# EAGLE schematic XstractiK_Domination_Player_UpperArm_V1 (EAGLE 9.6.2)

## Sheet 1 of 2
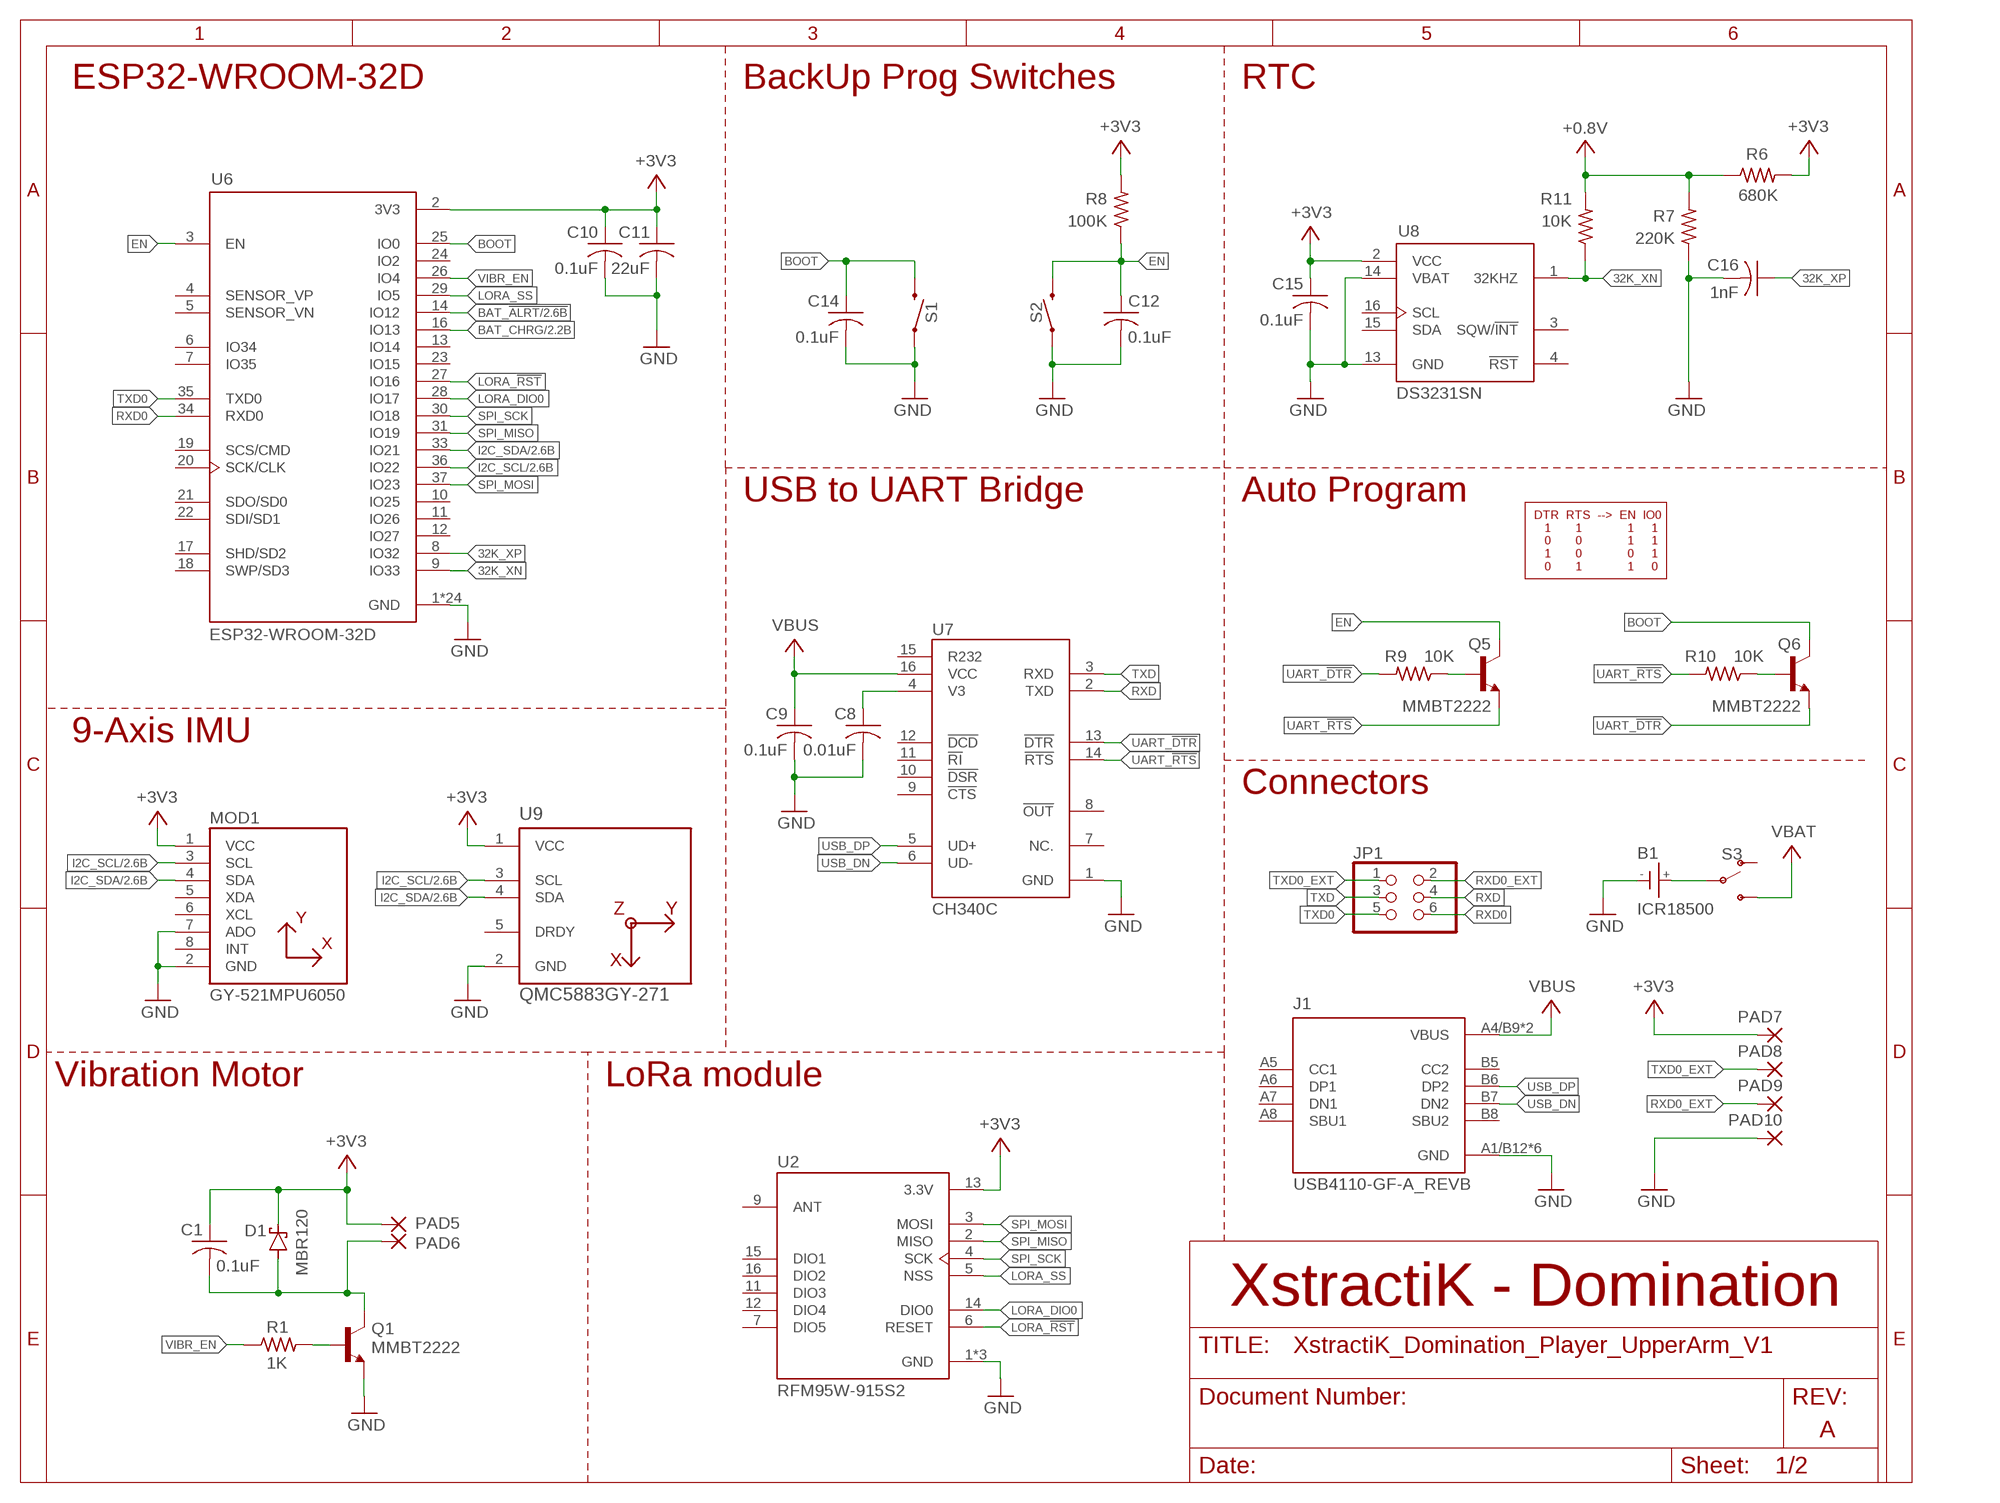
[diagram p0: schematic, sheet 1]

### Parts
B1  ICR18500  [ICR18500]
C1  0.1uF  C-USC0805  [C0805]
C8  0.01uF  C-USC0805  [C0805]
C9  0.1uF  C-USC0805  [C0805]
C10  0.1uF  C-USC0805  [C0805]
C11  22uF  C-USC0805  [C0805]
C12  0.1uF  C-USC0805  [C0805]
C14  0.1uF  C-USC0805  [C0805]
C15  0.1uF  C-USC0805  [C0805]
C16  1nF  C-USC0805  [C0805]
D1  ON_SEMICONDUCTOR_MBR120VLSFT1GON_SEMICONDUCTOR_MBR120VLSFT1G_0_0  [ON_SEMICONDUCTOR_MBR120VLSFT1G_0]
J1  USB4110-GF-A_REVB  [GCT_USB4110-GF-A_REVB]
JP1  PINHD-2X3  [2X03]
MOD1  GY-521MPU6050  [GY-521]
PAD5  WIREPAD1,6/0,8  [1,6/0,8]
PAD6  WIREPAD1,6/0,8  [1,6/0,8]
PAD7  WIREPADSMD1,27-254  [SMD1,27-2,54]
PAD8  WIREPADSMD1,27-254  [SMD1,27-2,54]
PAD9  WIREPADSMD1,27-254  [SMD1,27-2,54]
PAD10  WIREPADSMD1,27-254  [SMD1,27-2,54]
Q1  MMBT2222  [SOT23-BEC]
Q5  MMBT2222  [SOT23-BEC]
Q6  MMBT2222  [SOT23-BEC]
R1  1K  R-US_R0805  [R0805]
R6  680K  R-US_R0805  [R0805]
R7  220K  R-US_R0805  [R0805]
R8  100K  R-US_R0805  [R0805]
R9  10K  R-US_R0805  [R0805]
R10  10K  R-US_R0805  [R0805]
R11  10K  R-US_R0805  [R0805]
S1  MOMENTARY-SWITCH-SPST-SMD-5.2MM-TALL  [TACTILE_SWITCH_SMD_5.2MM]
S2  MOMENTARY-SWITCH-SPST-SMD-5.2MM-TALL  [TACTILE_SWITCH_SMD_5.2MM]
S3  SWITCH-SPDT-SMD-RIGHT-ANGLE  [SWITCH_SPST_SMD_A]
U2  RFM95W-915S2  [XCVR_RFM95W-915S2]
U6  ESP32-WROOM-32D  [MODULE_ESP32-WROOM-32D]
U7  CH340C  [SOIC127P600X180-16N]
U8  DS3231SN  [SOIC127P1032X265-16N]
U9  QMC5883GY-271  [GY-271]

### Nets
32K_XN: R11.1 U6.9(IO33) U8.1(32KHZ)
32K_XP: C16.1 U6.8(IO32)
+: B1.+ S3.2(P)
+0.8V: R6.1 R7.2 R11.2
+3V3: C1.1 C10.1 C11.1 C15.1 D1.1(K) MOD1.1(VCC) PAD5.1(P) PAD7.1(P) R6.2 R8.2 U2.13(3.3V) U6.2(3V3) U8.2(VCC) U9.1(VCC) ; also sheet 2
-: B1.- ; supply symbol labelled GND
BAT_!ALRT: U6.14(IO12) ; also sheet 2
BAT_CHRG: U6.16(IO13) ; also sheet 2
BOOT: C14.1 Q6.C S1.3 U6.25(IO0)
EN: C12.1 Q5.C R8.1 S2.3 U6.3(EN)
GND: C8.2 C9.2 C10.2 C11.2 C12.2 C14.2 C15.2 C16.2 J1.A1/B12(GND) J1.B1/A12(GND) J1.S1(GND) J1.S2(GND) J1.S3(GND) J1.S4(GND) MOD1.2(GND) MOD1.7(ADO) PAD10.1(P) Q1.E R7.1 S1.1 S2.1 U2.1(GND) U2.8(GND) U2.10(GND) U6.1(GND) U6.15(GND) U6.38(GND) U6.39_1(GND) U6.39_2(GND) U6.39_3(GND) U6.39_4(GND) U6.39_5(GND) U6.39_6(GND) U6.39_7(GND) U6.39_8(GND) U6.39_9(GND) U6.39_10(GND) U6.39_11(GND) U6.39_12(GND) U6.39_13(GND) U6.39_14(GND) U6.39_15(GND) U6.39_16(GND) U6.39_17(GND) U6.39_18(GND) U6.39_19(GND) U6.39_20(GND) U6.39_21(GND) U7.1(GND) U8.13(GND) U8.14(VBAT) U9.2(GND) ; also sheet 2
I2C_SCL: MOD1.3(SCL) U6.36(IO22) U9.3(SCL) ; also sheet 2
I2C_SDA: MOD1.4(SDA) U6.33(IO21) U9.4(SDA) ; also sheet 2
LORA_!RST: U2.6(RESET) U6.27(IO16)
LORA_DIO0: U2.14(DIO0) U6.28(IO17)
LORA_SS: U2.5(NSS) U6.29(IO5)
M-: C1.2 D1.2(A) PAD6.1(P) Q1.C
N$2: Q1.B R1.2
N$6: Q6.B R10.1
N$7: Q5.B R9.1
RXD: JP1.4 U7.2(TXD)
RXD0: JP1.6 U6.34(RXD0)
RXD0_EXT: JP1.2 PAD9.1(P)
SPI_MISO: U2.2(MISO) U6.31(IO19)
SPI_MOSI: U2.3(MOSI) U6.37(IO23)
SPI_SCK: U2.4(SCK) U6.30(IO18)
TXD: JP1.3 U7.3(RXD)
TXD0: JP1.5 U6.35(TXD0)
TXD0_EXT: JP1.1 PAD8.1(P)
UART_!DTR: Q6.E R9.2 U7.13(!DTR)
UART_!RTS: Q5.E R10.2 U7.14(!RTS)
USB_DN: J1.B7(DN2) U7.6(UD-)
USB_DP: J1.B6(DP2) U7.5(UD+)
V3: C8.1 U7.4(V3)
VBAT: S3.3(S) ; also sheet 2
VBUS: C9.1 J1.A4/B9(VBUS) J1.B4/A9(VBUS) U7.16(VCC) ; also sheet 2
VIBR_EN: R1.1 U6.26(IO4)
Unconnected: J1.A5(CC1) J1.A6(DP1) J1.A7(DN1) J1.A8(SBU1) J1.B5(CC2) J1.B8(SBU2) MOD1.5(XDA) MOD1.6(XCL) MOD1.8(INT) S3.1(O) U2.7(DIO5) U2.9(ANT) U2.11(DIO3) U2.12(DIO4) U2.15(DIO1) U2.16(DIO2) U6.4(SENSOR_VP) U6.5(SENSOR_VN) U6.6(IO34) U6.7(IO35) U6.10(IO25) U6.11(IO26) U6.12(IO27) U6.13(IO14) U6.17(SHD/SD2) U6.18(SWP/SD3) U6.19(SCS/CMD) U6.20(SCK/CLK) U6.21(SDO/SD0) U6.22(SDI/SD1) U6.23(IO15) U6.24(IO2) U7.7(NC.) U7.8(!OUT) U7.9(!CTS) U7.10(!DSR) U7.11(!RI) U7.12(!DCD) U7.15(R232) U8.3(SQW/!INT) U8.4(!RST) U8.15(SDA) U8.16(SCL) U9.5(DRDY)

### Notes on the sheet
- ESP32-WROOM-32D | BackUp Prog Switches | RTC
- USB to UART Bridge | Auto Program
- DTR  RTS  -->  EN  IO0
     1       1             1     1
     0       0             1     1
     1       0             0     1
     0       1             1     0
- 9-Axis IMU
- Connectors
- Vibration Motor | LoRa module
- XstractiK - Domination
- A

## Sheet 2 of 2
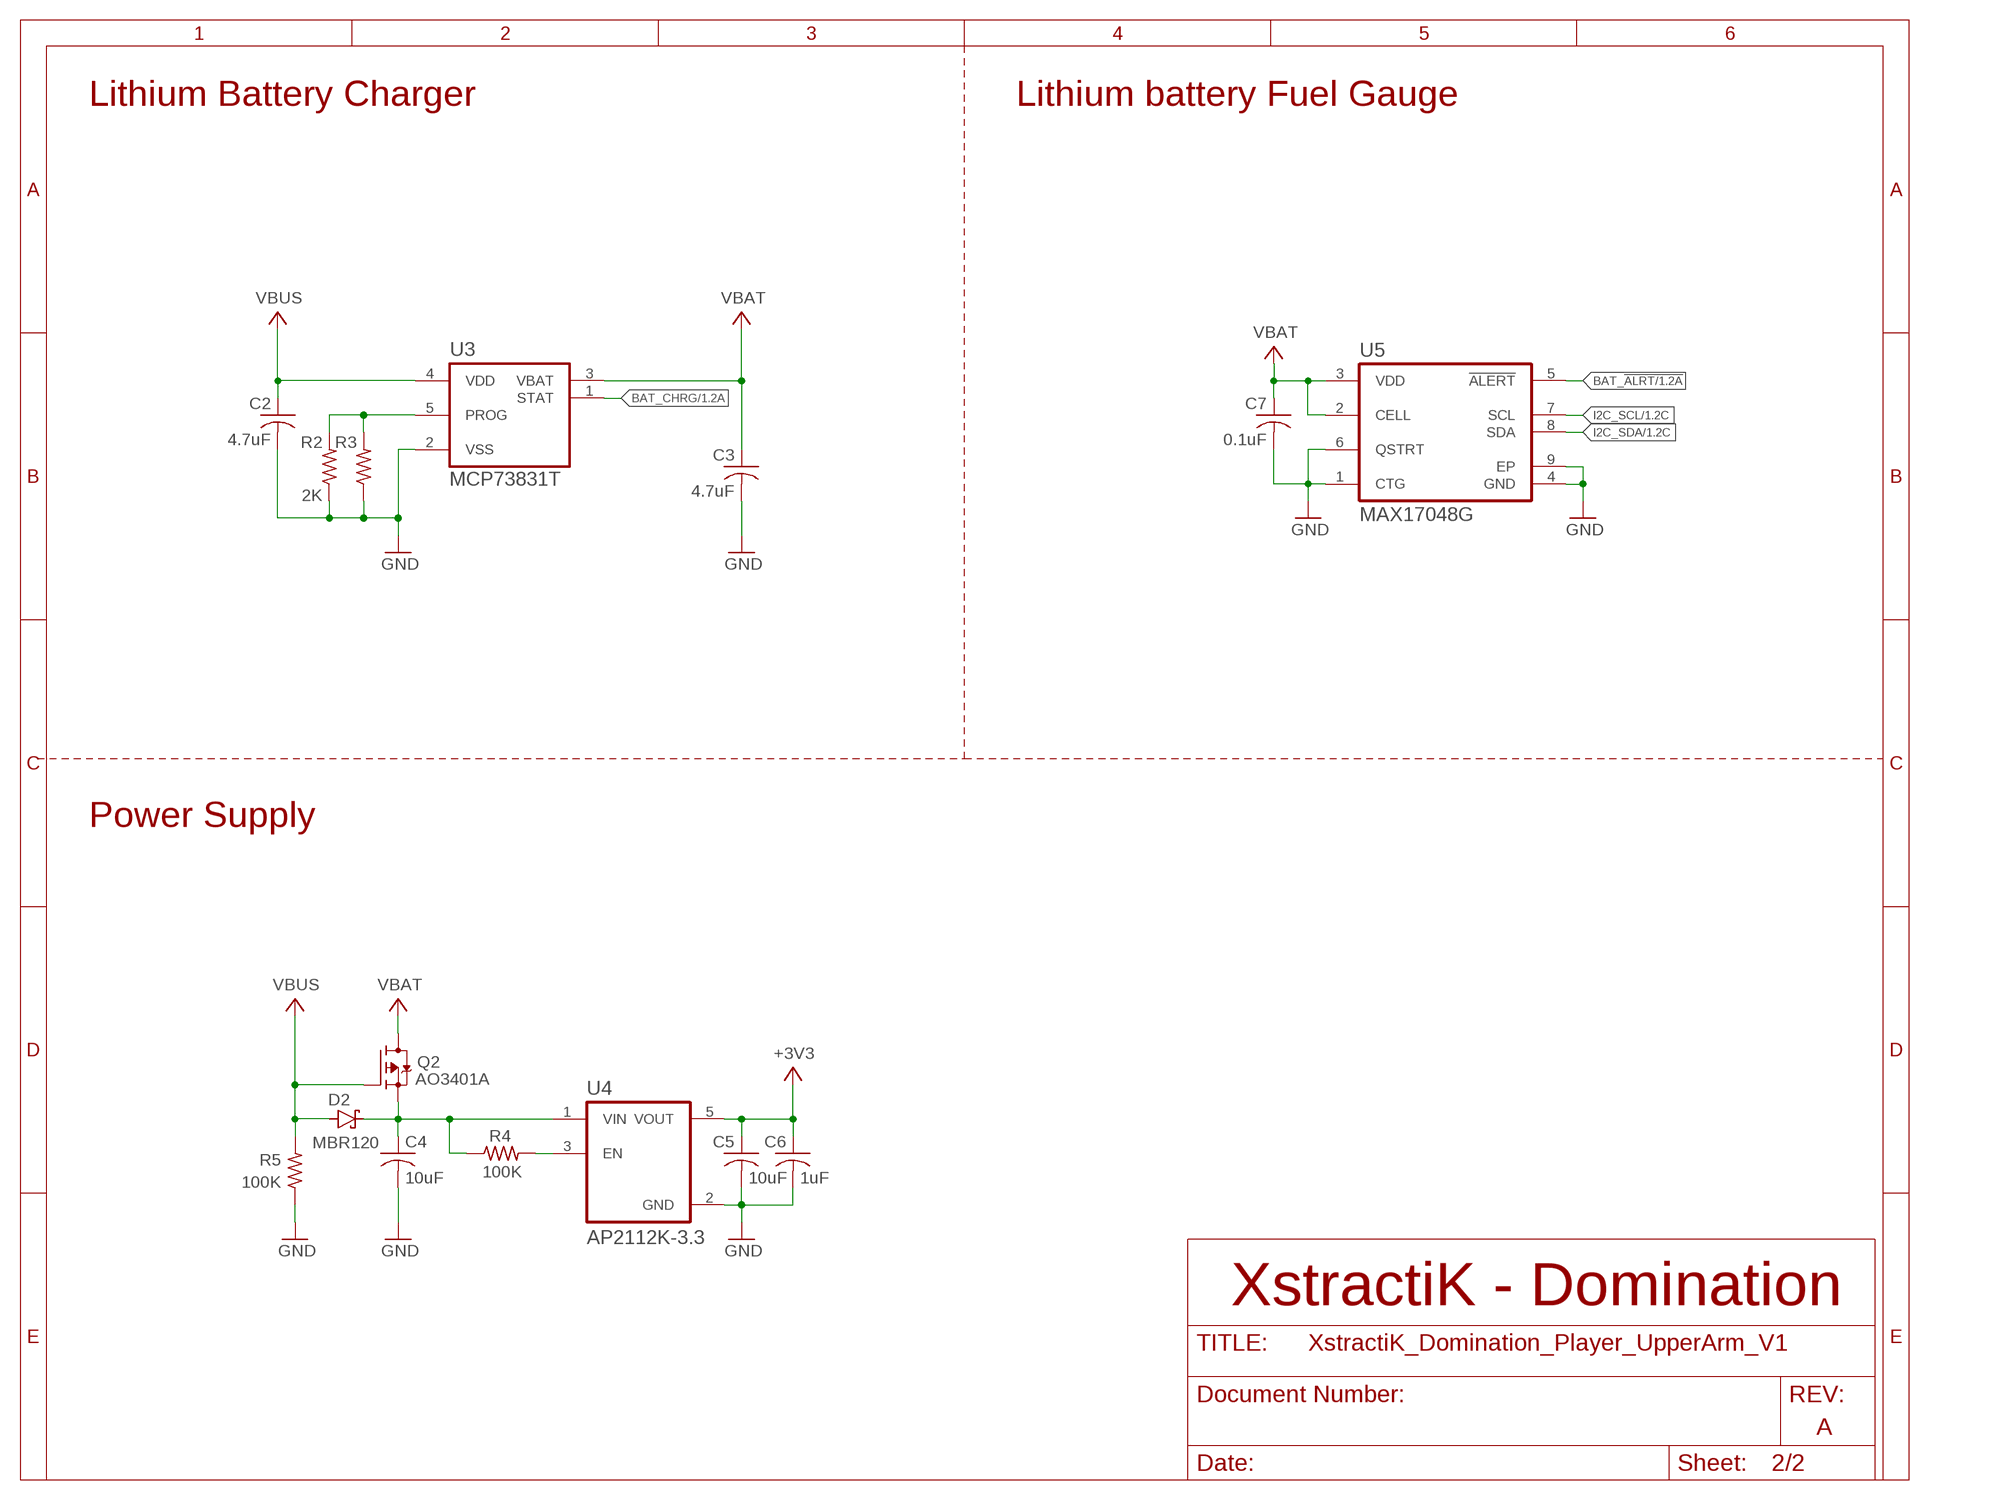
[diagram p1: schematic, sheet 2]

### Parts
C2  4.7uF  C-USC0805  [C0805]
C3  4.7uF  C-USC0805  [C0805]
C4  10uF  C-USC0805  [C0805]
C5  10uF  C-USC0805  [C0805]
C6  1uF  C-USC0805  [C0805]
C7  0.1uF  C-USC0805  [C0805]
D2  ON_SEMICONDUCTOR_MBR120VLSFT1GON_SEMICONDUCTOR_MBR120VLSFT1G_0_0  [ON_SEMICONDUCTOR_MBR120VLSFT1G_0]
Q2  AO3401A  [SOT23-3]
R2  2K  R-US_R0805  [R0805]
R3  R-US_R0805  [R0805]
R4  100K  R-US_R0805  [R0805]
R5  100K  R-US_R0805  [R0805]
U3  MCP73831T  [SOT95P270X145-5N]
U4  AP2112K-3.3  [SOT95P285X140-5N]
U5  MAX17048G  [SON50P200X200X80-9N]

### Nets
+3V3: C5.1 C6.1 U4.5(VOUT) ; also sheet 1
BAT_!ALRT: U5.5(!ALERT) ; also sheet 1
BAT_CHRG: U3.1(STAT) ; also sheet 1
CHRG_PROG: R2.2 R3.2 U3.5(PROG)
GND: C2.2 C3.2 C4.2 C5.2 C6.2 C7.2 R2.1 R3.1 R5.1 U3.2(VSS) U4.2(GND) U5.1(CTG) U5.4(GND) U5.6(QSTRT) U5.9(EP) ; also sheet 1
I2C_SCL: U5.7(SCL) ; also sheet 1
I2C_SDA: U5.8(SDA) ; also sheet 1
REG_EN: R4.2 U4.3(EN)
REG_VIN: C4.1 D2.1(K) Q2.2(S) R4.1 U4.1(VIN)
VBAT: C3.1 C7.1 Q2.3(D) U3.3(VBAT) U5.2(CELL) U5.3(VDD) ; also sheet 1
VBUS: C2.1 D2.2(A) Q2.1(G) R5.2 U3.4(VDD) ; also sheet 1

### Notes on the sheet
- Lithium Battery Charger | Lithium battery Fuel Gauge
- Power Supply
- XstractiK - Domination
- A

## Library data of the parts
B1 = Batteries:ICR18500
C1-C12 C14-C16 = rcl:C-US: CAPACITOR, American symbol; SPICEPREFIX: C
D1 D2 = MBR120VLSFT1G:ON_SEMICONDUCTOR_MBR120VLSFT1G: ONSC-D-K1A2-2_A; COMPONENT_LINK_1_DESCRIPTION: Manufacturer URL; COMPONENT_LINK_1_URL: http://www.onsemi.com/; COMPONENT_LINK_3_DESCRIPTION: Package Specification; COMPONENT_LINK_3_URL: http://www.onsemi.cn/pub_link/Collateral/MBR120VLSFT1-D.PDF; CONFIGURATION: Single; DATASHEET: http://www.onsemi.cn/pub_link/Collateral/MBR120VLSFT1-D.PDF; DATASHEET_VERSION: Rev. 2; IFSM_MAX_A: 45; IMPORTED: yes; IMPORTED_FROM: vault; IMPORT_TS: 1521178043; MF: On Semiconductor; MOUNTING_TECHNOLOGY: Surface Mount; MPN: MBR120VLSFT1G; PACKAGE: SOD-123FL-2-498-01; PACKAGE_DESCRIPTION: 2-Pin SOD, Body 1.65 x 2.7 mm; PACKAGE_VERSION: Rev. A; PACKING: Tape and Reel; PREFIX: D; ROHS: Yes; VAULT_GUID: 4A61E613-4CE2-4B75-A462-25A6CC2A8907; VAULT_REVISION: 780FB999-FC13-4133-9298-794FC10DBA1F
J1 = USB-C-SMD:USB4110-GF-A_REVB: Check availability <https://pricing.snapeda.com/parts/USB4110-GF-A/GCT/view-part?ref=eda>; AVAILABILITY: In Stock; DESCRIPTION: USB-C (USB TYPE-C) USB 2.0 Receptacle Connector 24 (16+8 Dummy) Position Surface Mount, Right Angle; Through Hole; MF: GCT; MP: USB4110-GF-A; PACKAGE: None; PRICE: None; PURCHASE-URL: https://pricing.snapeda.com/search/part/USB4110-GF-A/?ref=eda
JP1 = pinhead:PINHD-2X3: PIN HEADER
MOD1 = MPU6050:GY-521: GY-521 PIM for MPU6050 Check availability <https://pricing.snapeda.com/parts/GY-521/GODREAM%20FORDREAM%20CO.%2C%20LIMITED/view-part?ref=eda>; AVAILABILITY: Not in stock; DESCRIPTION: Triple Axis Accelerometer Gyro Breakout; MF: GODREAM FORDREAM CO., LIMITED; MP: GY-521; PACKAGE: Package; PRICE: None
PAD5-PAD10 = wirepad:WIREPAD: Wire PAD connect wire on PCB
Q1 Q5 Q6 = MMBT2222:MMBT2222*: NPN Transistor Check availability <https://pricing.snapeda.com/parts/MMBT2222/ON%20Semiconductor/view-part?ref=eda>; AVAILABILITY: In Stock; DESCRIPTION: Bipolar (BJT) Transistor NPN 30 V 600 mA 250MHz 300 mW Surface Mount SOT-23-3 (TO-236); MF: ON Semiconductor; MP: MMBT2222; PACKAGE: SOT-23-3 Fairchild Semiconductor; PRICE: None; PURCHASE-URL: https://pricing.snapeda.com/search/part/MMBT2222/?ref=eda
Q2 = AO3401A:AO3401A: Tipo de transistor P-MOSFET Polarización unipolar Tensión drenaje-fuente -30V Corriente del drenaje -4A Poder disipado 1.4W Carcasa SOT23 Tensión puerta-fuente ±12V Check availability <https://pricing.snapeda.com/parts/AO3401A/Alpha%20%26%20Omega%20Semiconductor%20Inc./view-part?ref=eda>; AVAILABILITY: In Stock; DESCRIPTION: P-Channel 30 V 4A (Ta) 1.4W (Ta) Surface Mount SOT-23-3; MF: Alpha & Omega Semiconductor Inc.; MP: AO3401A; PACKAGE: TO-236-3 Alpha &amp; Omega Semiconductor Inc.; PRICE: None; PURCHASE-URL: https://pricing.snapeda.com/search/part/AO3401A/?ref=eda
R1-R11 = rcl:R-US_: RESISTOR, American symbol; SPICEPREFIX: R
S1 S2 = Switches:MOMENTARY-SWITCH-SPST: Momentary Switch (Pushbutton) - SPST Normally-open (NO) SPST momentary switches (buttons, pushbuttons). Variants PTH-12MM - 12mm square, through-hole Momentary Pushbutton Switch - 12mm Square <https://www.sparkfun.com/products/9190> (COM-09190) PTH-6.0MM, PTH-6.0MM-KIT - 6.0mm square, through-hole Mini Pushbutton Switch <https://www.sparkfun.com/products/97> (COM-00097) KIT package intended for soldering kit's - only one side of pads' copper is exposed. PTH-RIGHT-ANGLE-KIT - Right-angle, through-hole Right Angle Tactile Button <https://www.sparkfun.com/products/10791> - Used on SparkFun BigTime Watch Kit <https://www.sparkfun.com/products/11734> SMD-12MM - 12mm square, surface-mount Tactile Button - SMD (12mm) <https://www.sparkfun.com/products/12993> (COM-12993) Used on SparkFun PicoBoard <https://www.sparkfun.com/products/11888> SMD-4.5MM - 4.5mm Square Trackball Switch Used on SparkFun Blackberry Trackballer Breakout <https://www.sparkfun.com/products/13169> SMD-4.6MMX2.8MM - 4.60mm x 2.80mm, surface mount Used on SparkFun Pro Micro - RP2040 <https://www.sparkfun.com/products/17717> SMD-5.2MM, SMD-5.2-REDUNDANT - 5.2mm square, surface-mount Mini Pushbutton Switch - SMD <https://www.sparkfun.com/products/8720> (COM-08720) Used on Arduino Pro Mini <https://www.sparkfun.com/products/11114> REDUNDANT package connects both switch circuits together SMD-6.0X3.5MM - 6.0 x 3.5mm, surface mount Momentary Reset Switch SMD <https://www.sparkfun.com/products/8229> (COM-08229) SMD-6.2MM-TALL - 6.2mm square, surface mount Tactile Button - SMD (6mm) <https://www.sparkfun.com/products/12992> Used on SparkFun Digital Sandbox <https://www.sparkfun.com/products/12651> SMD-RIGHT-ANGLE - Right-angle, surface mount Used on SparkFun Block for Intel® Edison - Arduino <https://www.sparkfun.com/products/13036>; PROD_ID: SWCH-14139
S3 = Switches:SWITCH-SPDT: Single Pole, Double Throw (SPDT) Switch Single-pole, double-throw (SPDT) switch. Variant Overview SMD-AYZ0202 Surface Mount DPDT Switch <https://www.sparkfun.com/products/597> (COM-00597) Used on e.g. LilyPad Arduino USB - ATmega32U4 Board <https://www.sparkfun.com/products/12049> PTH-11.6X4.0MM SPDT Mini Power Switch <https://www.sparkfun.com/products/102> (COM-00102) Used on e.g. SparkFun Simon Says - Through-Hole Soldering Kit <https://www.sparkfun.com/products/10547> (KIT-10547) PTH-11.6X4.0MM-KIT KIT version of SPDT Mini Power Switch - Simplifies soldering by removing tStop of switch pins - only one side can be soldered. PTH-11.6X4.0MM-LOCK LOCK version of SPDT Mini Power Switch - Offset pins hold switch in place for easier soldering. SMD-RIGHT-ANGLE Surface Mount Right Angle Switch <https://www.sparkfun.com/products/10860> (COM-10860) Used on e.g. SparkFun ESP8266 Thing <https://www.sparkfun.com/products/13231>; PROD_ID: SWCH-10651; SF_SKU: COM-10860
U2 = RFM95W-915S2:RFM95W-915S2: RFM95(W) - Low Power Long Range Transceiver Module V1.0 Check availability <https://pricing.snapeda.com/parts/RFM95W-915S2/RF%20Solutions/view-part?ref=eda>; AVAILABILITY: In Stock; DESCRIPTION: 802.15.4 LoRa™ Transceiver Module 915MHz Antenna Not Included Surface Mount; MF: RF Solutions; MP: RFM95W-915S2; PACKAGE: SMD-16 RF Solutions; PRICE: None; PURCHASE-URL: https://pricing.snapeda.com/search/part/RFM95W-915S2/?ref=eda
U3 = MCP73831T-3ACI_OT:MCP73831T: Li-Polymer Charge Management Controllers, SOT23-5 Check availability <https://pricing.snapeda.com/parts/MCP73831T-3ACI/OT/Microchip/view-part?ref=eda>; AVAILABILITY: In Stock; DESCRIPTION: Charger IC Lithium Ion/Polymer SOT-23-5; MF: Microchip; MP: MCP73831T-3ACI/OT; PACKAGE: SOT-23-5 Microchip; PRICE: None; PURCHASE-URL: https://pricing.snapeda.com/search/part/MCP73831T-3ACI/OT/?ref=eda
U4 = AP2112K-3.3TRG1:AP2112K-3.3: AP2112 Series 0.6 A 3.3 V Fixed Output SMT LDO Linear Regulator - SOT23-5 Check availability <https://pricing.snapeda.com/parts/AP2112K-3.3TRG1/Diodes%20Inc./view-part?ref=eda>; AVAILABILITY: In Stock; DESCRIPTION: Linear Voltage Regulator IC Positive Fixed 1 Output 600mA SOT-25; MF: Diodes Inc.; MP: AP2112K-3.3TRG1; PACKAGE: SOT-753 Diodes Inc.; PRICE: None; PURCHASE-URL: https://pricing.snapeda.com/search/part/AP2112K-3.3TRG1/?ref=eda
U5 = MAX17048G:MAX17048G: Check availability <https://pricing.snapeda.com/parts/MAX17048G/Maxim%20Integrated/view-part?ref=eda>; AVAILABILITY: In Stock; DESCRIPTION: Battery Battery Monitor IC Lithium Ion 8-TDFN-EP (2x2); MF: Maxim Integrated; MP: MAX17048G; PACKAGE: TDFN-8 Maxim; PRICE: None; PURCHASE-URL: https://pricing.snapeda.com/search/part/MAX17048G/?ref=eda
U6 = ESP32-WROOM-32D:ESP32-WROOM-32D: Bluetooth, WiFi 802.11b/g/n, Bluetooth v4.2 + EDR, Class 1, 2 and 3 Transceiver Module 2.4GHz ~ 2.5GHz Integrated, Trace Surface Mount Check availability <https://pricing.snapeda.com/parts/ESP32-WROOM-32D/Espressif%20Systems/view-part?ref=eda>; AVAILABILITY: In Stock; DESCRIPTION: Bluetooth, WiFi 802.11b/g/n, Bluetooth v4.2 +EDR, Class 1, 2 and 3 Transceiver Module 2.4GHz ~ 2.5GHz Integrated; MF: Espressif Systems; MP: ESP32-WROOM-32D; PACKAGE: Module Espressif Systems; PRICE: None; PURCHASE-URL: https://pricing.snapeda.com/search/part/ESP32-WROOM-32D/?ref=eda
U7 = CH340C:CH340C: USB to serial chip CH340 Check availability <https://pricing.snapeda.com/parts/CH340C/WCH/view-part?ref=eda>; AVAILABILITY: Not in stock; DESCRIPTION: USB to serial chip CH340; MF: WCH; MP: CH340C; PACKAGE: None; PRICE: None
U8 = DS3231SN:DS3231SN: Real Time Clock Serial 16-Pin SOIC W T/R Check availability <https://pricing.snapeda.com/parts/DS3231SN/Maxim%20Integrated/view-part?ref=eda>; AVAILABILITY: In Stock; DESCRIPTION: Real Time Clock (RTC) IC Clock/Calendar - I²C, 2-Wire Serial 16-SOIC (0.295, 7.50mm Width); MF: Maxim Integrated; MP: DS3231SN; PACKAGE: SOIC-16 Maxim; PRICE: None; PURCHASE-URL: https://pricing.snapeda.com/search/part/DS3231SN/?ref=eda
U9 = QMC5883:QMC5883